# EasyEDA Pro project ProProject_audio_project_2024-04-19.epro

# Schematic Schematic1
Create Date: 2024-04-14; Page Name: P1; Project Name: audio_project; Schematic Name: Schematic1; Update Date: 2024-04-17; Company: 嘉立创EDA; Page Size: A4; Version: V1.0
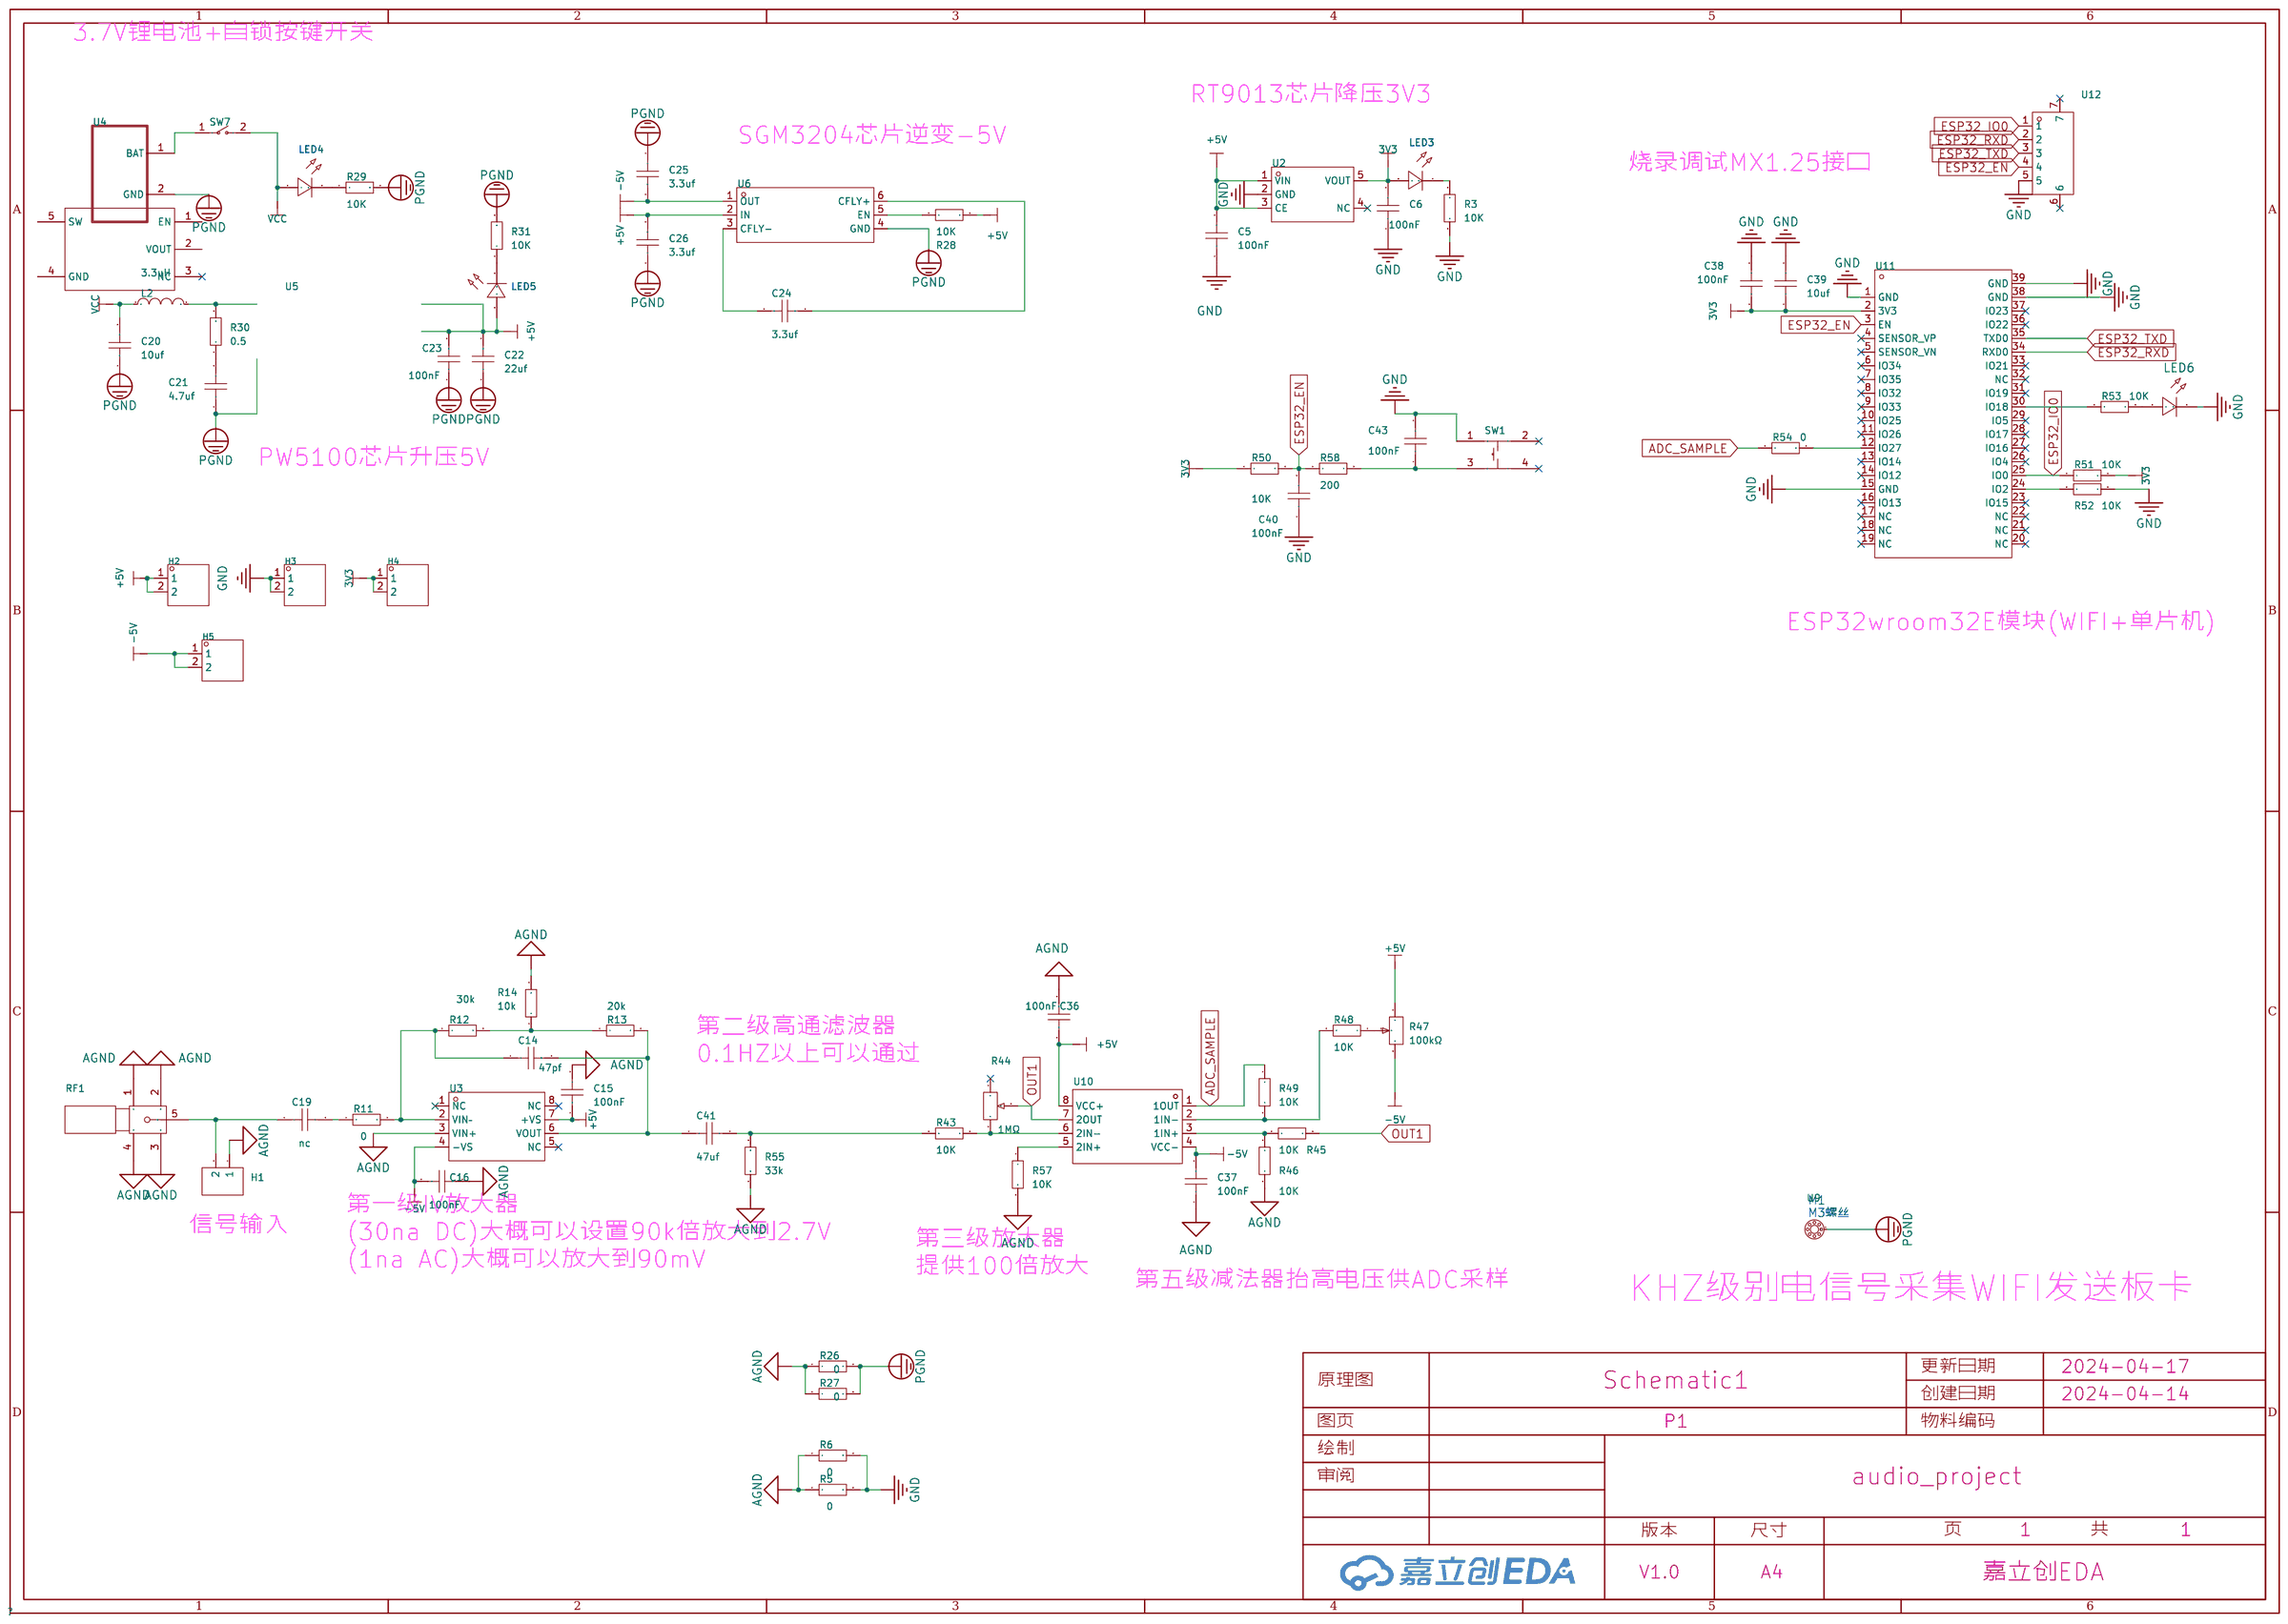
[diagram p0: schematic sheet]

## Parts
C5  100nF  [C0603]
C6  100nF  [C0603]
C14  47pf  [C0603]
C15  100nF  [C0603]
C16  100nF  [C0603]
C19  nc  [C0603]
C20  10uf  [C0805]
C21  4.7uf  [C0603]
C22  22uf  [C0805]
C23  100nF  [C0603]
C24  3.3uf  [C0603]
C25  3.3uf  [C0603]
C26  3.3uf  [C0603]
C36  100nF  [C0603]
C37  100nF  [C0603]
C38  100nF  [C0603]
C39  10uf  [C0805]
C40  100nF  [C0603]
C41  47uf  [C0805]
C43  100nF  [C0603]
H1  -  [HDR-TH_2P-P2.54-V-F]
H2  -  [HDR-TH_2P-P2.54-V-M-1]
H3  -  [HDR-TH_2P-P2.54-V-M-1]
H4  -  [HDR-TH_2P-P2.54-V-M-1]
H5  -  [HDR-TH_2P-P2.54-V-M-1]
L2  3.3uH  [IND-SMD_L4.0-W4.0_FNR40XXS]
LED3  -  [LED_0805]
LED4  -  [LED_0805]
LED5  -  [LED_0805]
LED6  -  [LED_0805]
R3  10K  [R0603]
R5  0  [R0603]
R6  0  [R0603]
R11  0  [R0603]
R12  30k  [R0603]
R13  20k  [R0603]
R14  10k  [R0603]
R26  0  [R0603]
R27  0  [R0603]
R28  10K  [R0603]
R29  10K  [R0603]
R30  0.5  [R0603]
R31  10K  [R0603]
R43  10K  [R0603]
R44  1MΩ  [RES-ADJ-TH_3P-L7.1-W6.9-P2.50-L_3362P]
R45  10K  [R0603]
R46  10K  [R0603]
R47  100kΩ  [RES-ADJ-TH_3296W]
R48  10K  [R0603]
R49  10K  [R0603]
R50  10K  [R0603]
R51  10K  [R0603]
R52  10K  [R0603]
R53  10K  [R0603]
R54  0  [R0603]
R55  33k  [R0603]
R57  10K  [R0603]
R58  200  [R0603]
RF1  BWSMA-KWE-Z001  [SMA-TH_BWSMA-KWE-Z001]
SW1  K2-1808SN-A3SW-01  [SW-SMD_4P-L4.2-W3.3-P2.15-LS5.1]
SW7  KCD11-2P-R  [SW-TH_2P-L15.0-W10.5-P5.00_KCD11-2P-R]
U2  RT9013-33GB-MS  [SOT-23-5_L2.9-W1.6-P0.95-LS2.8-BR]
U3  OPA657U  [SOIC-8_L4.9-W3.9-P1.27-LS6.0-TL]
U4  -  [两个焊盘]
U5  3c0bada92d29401ea73ee46ec49cffd6  [SOT-23-5_L2.9-W1.6-P0.95-LS2.8-TL]
U6  SGM3204YN6G/TR  [SOT-23-6_L2.9-W1.6-P0.95-LS2.8-BR]
U9  -  [m3]
U10  LF353DR  [SOIC-8_L5.0-W4.0-P1.27-LS6.0-BL]
U11  ESP32-WROOM-32E  [WIFI-SMD_ESP32-WROOM-32E-A]
U12  ZX-MX1.25-5PLT  [CONN-SMD_5P-P1.25_MEGASTAR_ZX-MX1.25-5PLT]

## Library data of the parts
C5 C6 C14-C16 C19 C21 C23-C26 C36-C38 C40 C43 = CAP_0603: Supplier Footprint: 0603
C20 C22 C39 C41 = CAP_0805: Supplier Footprint: 0805
H1 = HDR-F_2.54_1x2P: Supplier Part: C49661; Supplier Footprint: 插件
H2-H5 = HDR-M_2.54_1x2P: Supplier Part: C124375; Supplier Footprint: 插件
L2 = FNR4030S3R3MT: 电感值:3.3uH;精度:±20%;额定电流:2.6A;饱和电流(Isat):3.6A;; LCSC Part Name: 3.3uH ±20% 3.6A; Supplier Part: C167870; Manufacturer: cjiang(长江微电); Supplier Footprint: SMD,4x4mm; JLCPCB Part Class: 扩展库; Datasheet: https://atta.szlcsc.com/upload/public/pdf/source/20190327/C167925_9EFF0AABC4CA629C2CC95961DBF7D39D.pdf; Supplier: LCSC; Tolerance: ±20%; Rated Current: 2.6A; Saturation Current (Isat): 3.6A; DC Resistance (DCR): 52mΩ
LED3-LED5 = LED_0805-G: Supplier Footprint: 0805
LED6 = LED_0805-R: Supplier Footprint: 0805
R3 R5 R6 R11-R14 R26-R31 R43 R45 R46 R48-R55 R57 R58 = Res_0603: Supplier Footprint: 0603
R44 = 3362P-1-105: 阻值:1MΩ;精度:±10%;; LCSC Part Name: 1MΩ ±10%; Supplier Part: C118945; Manufacturer: BOCHEN(博晨); Supplier Footprint: 插件; JLCPCB Part Class: 扩展库; Datasheet: https://atta.szlcsc.com/upload/public/pdf/source/20171114/C118945_15106326627791117434.pdf; Supplier: LCSC; Tolerance: ±10%
R47 = 3296W-1-104LF: 阻值:100kΩ;精度:±10%;; LCSC Part Name: 100kΩ ±10%; Supplier Part: C48084; Manufacturer: BOURNS; Supplier Footprint: 插件; JLCPCB Part Class: 扩展库; Datasheet: https://atta.szlcsc.com/upload/public/pdf/source/20150811/1457707339453.pdf; Supplier: LCSC; Tolerance: ±10%
RF1 = BWSMA-KWE-Z001: 连接器类型:板端;接口类型:内孔;端口数量:1;接口直径:5.3mm;接口长度/高度:-;频率-最大值:-;射频系列:SMA;阻抗:50Ω;样式:弯头;触头材质:-;触头镀层:-;工作温度范围:-;焊接温度(最大值):-;; LCSC Part Name: 内孔 SMA 弯头; Supplier Part: C496551; Manufacturer: BAT WIRELESS(蝙蝠无线); Supplier Footprint: 插件; JLCPCB Part Class: 扩展库; Datasheet: https://atta.szlcsc.com/upload/public/pdf/source/20231017/997A8C2ADA7F8034A89BE1264F38CE52.pdf; Supplier: LCSC; Connector Type: 板端; Interface Type: 内孔; Number of Ports: 1; Interface Diameter: 5.3mm; RF Series: SMA; Impedance: 50Ω; Style: 弯头
SW1 = K2-1808SN-A3SW-01: 触点电流:50mA;额定电压(DC):12V;绝缘电阻:100MΩ;安装方式:立贴;作用力:180gf@±30gf;机械寿命:100000;工作温度:-25℃~+85℃;开关长度:4.2mm;开关宽度:3.25mm;开关高度:2.5mm;; LCSC Part Name: 3*4*2.5 贴片开关180G; Supplier Part: C2690012; Manufacturer: 韩国韩荣; Supplier Footprint: SMD; JLCPCB Part Class: 扩展库; Datasheet: https://atta.szlcsc.com/upload/public/pdf/source/20180927/C283535_7E7907F3E7B6C1691E1DC87E363D082A.pdf; Supplier: LCSC; Contact Current: 50mA; Voltage Rating (DC): 12V; Insulation Resistance: 100MΩ; Mounting Sytle: 立贴; Operating Force: 180gf@±30gf; Mechanical Life: 100000; Operating Temperature: -25℃~+85℃; Switch Length: 4.2mm; Switch Width: 3.25mm; Switch Height: 2.5mm
SW7 = KCD11-2P-R: 带灯:无;引脚样式:焊片;额定电流:3A;额定电压(AC):250V;额定电压(DC):-;电路结构:单刀单掷;机械寿命:1万次;; LCSC Part Name: 10.5*15mm 两脚两档跷板开关 红钮; Supplier Part: C5884414; Manufacturer: SHOU HAN(首韩); Supplier Footprint: 插件; JLCPCB Part Class: 扩展库; Datasheet: https://atta.szlcsc.com/upload/public/pdf/source/20230506/CD06DFDE35C8048D34175BFF4AF6A2C2.pdf; Supplier: LCSC; Switch Length: 15mm; Switch Width: 10.5mm; Switch Height: 17.2mm; Actuator Type: 凹面弯曲; With Lamp: 无; Pin Style: 焊片; Actuator Color: 红色; Contact Current: 3A; Voltage Rating (AC): 250V; Circuit: 单刀单掷; Mechanical Life: 1万次; Operating Temperature: 0℃~+125℃; Actuator Identifier: - O
U2 = RT9013-33GB-MS: 输出类型:固定;最大输入电压:5.5V;输出电压:3.3V;输出电流:500mA;电源纹波抑制比(PSRR):75dB@(1kHz);输出极性:正极;; Supplier Part: C7434207; Manufacturer: MSKSEMI(美森科); Supplier Footprint: SOT-23-5; JLCPCB Part Class: 扩展库; Datasheet: https://atta.szlcsc.com/upload/public/pdf/source/20230705/1D6536D82D93AC1E044F3DAE104751D9.pdf; Supplier: LCSC; Output Type: 固定; Maximum Input Voltage: 5.5V; Output Voltage: 3.3V; Output Current: 500mA; Power Supply Rejection Ratio (PSRR): 75dB@(1kHz); Output Polarity: 正极
U3 = OPA657U: 1.6GHz、低噪声、FET 输入运算放大器 8-SOIC -40 to 85; Supplier Part: C2878144; Manufacturer: TI(德州仪器); Supplier Footprint: SOIC-8; JLCPCB Part Class: 扩展库; Supplier: LCSC
U4 = 两个焊盘
U5 = PW5100: 锂电池DC-DC高效同步升压变换器
U6 = SGM3204YN6G/TR: 功能类型:电荷泵;输入电压:1.4V~5.5V;输出电压:-5.5V~-1.4V;输出电流(最大值):200mA;; Supplier Part: C194031; Manufacturer: SGMICRO(圣邦微); Supplier Footprint: SOT-23-6; JLCPCB Part Class: 扩展库; Datasheet: https://atta.szlcsc.com/upload/public/pdf/source/20180627/C194031_755051E53122D645C36CF727711B963E.pdf; Supplier: LCSC; Function: 电荷泵; Input Voltage: 1.4V~5.5V; Output Voltage: -5.5V~-1.4V; Output Current (Max): 200mA; Switching Frequency: 950kHz; Number of Outputs: 1
U9 = M3焊盘
U10 = LF353DR: 运放类型:J-FET;放大器组数:2;增益带宽积（GBP）:3MHz;压摆率（SR）:13 V/us;电源电压:±3.5V ~ 18V;各通道供电电流:3.6mA;; Supplier Part: C7918; Manufacturer: TI(德州仪器); Supplier Footprint: SOIC-8-150mil; JLCPCB Part Class: 扩展库; Datasheet: https://atta.szlcsc.com/upload/public/pdf/source/20180308/C7918_15204885487891413793.pdf; Supplier: LCSC; Amplifier Type: J-FET; Number of Circuits: 2; Gain Bandwidth Product（GBP）: 3MHz; Slew Rate（SR）: 13 V/us; Supply Voltage（Single）: ±3.5V ~ 18V; Iq per channel (Typ): 3.6mA; Operating Temperature: 0°C ~ 70°C
U11 = ESP32-WROOM-32E: Supplier Part: C2973652; Manufacturer: ESPRESSIF(乐鑫); Supplier Footprint: SMD,18x25.5mm; JLCPCB Part Class: Extended Part; Datasheet: https://atta.szlcsc.com/upload/public/pdf/source/20220506/2B7DF1E5B41DABC7447F735C715CAF22.pdf; Supplier: LCSC
U12 = ZX-MX1.25-5PLT: 插针结构:1x5P;间距:1.25mm;安装方式:立贴;参考系列:-;总PIN数:5P;排数:1;每排PIN数:5;行距:-;额定电流:1A;触头材质:黄铜;触头镀层:锡;工作温度范围:-25℃~+85℃;; LCSC Part Name: 1x5P 间距:1.25mm 立贴; Supplier Part: C7430476; Manufacturer: Megastar(兆星); Supplier Footprint: SMD,P=1.25mm; JLCPCB Part Class: 扩展库; Datasheet: https://atta.szlcsc.com/upload/public/pdf/source/20230619/51DE3896F53EA722A95969B8F38DD13F.pdf; Supplier: LCSC; Pins Structure: 1x5P; Pitch: 1.25mm; Mounting Style: 立贴; Number of Pins: 5P; Number of Rows: 1; Number of PINs Per Row: 5; Current Rating (Max): 1A; Contact Material: 黄铜; Contact Plating: 锡; Operating Temperature Range: -25℃~+85℃

## Nets
3V3: C6.2 C38.2 C39.1 H4.1 H4.2 LED3.2(A) R50.1 R51.2 U2.5(VOUT) U11.2(3V3)
+5V: C5.2 C15.1 C22.2 C23.2 C26.2 C36.1 H2.1 H2.2 LED5.2(A) R28.2 R47.1 U2.1(VIN) U2.3(CE) U3.7(+VS) U6.2(IN) U10.8(VCC+)
-5V: C16.2 C25.2 C37.2 H5.1 H5.2 R47.3 U3.4(-VS) U6.1(OUT) U10.4(VCC-)
AGND: C15.2 C16.1 C36.2 C37.1 H1.1 R5.1 R6.1 R14.2 R26.1 R27.1 R46.1 R55.1 R57.2 RF1.1 RF1.2 RF1.3 RF1.4 U3.3(VIN+)
GND: C5.1 C6.1 C38.1 C39.2 C40.1 C43.2 H3.1 H3.2 LED6.1(C) R3.2 R5.2 R6.2 R52.2 SW1.1 U2.2(GND) U11.1(GND) U11.15(GND) U11.38(GND) U11.39(GND) U12.5
PGND: C20.1 C21.1 C22.1 C23.1 C25.1 C26.1 R26.2 R27.2 R29.2 R31.2 U4.2(GND) U6.4(GND) U9.1
VCC: C20.2 L2.1 LED4.2(A) SW7.2
ADC_SAMPLE: R49.1 R54.1 U10.1(1OUT)
ESP32_EN: C40.2 R50.2 R58.1 U11.3(EN) U12.4
ESP32_IO0: R51.1 U11.25(IO0) U12.1
ESP32_RXD: U11.34(RXD0) U12.2
ESP32_TXD: U11.35(TXD0) U12.3
OUT1: R44.2 R45.2 U10.7(2OUT)
$1N488: R12.2 R13.1 R14.1
$1N489: C14.1 R11.2 R12.1 U3.2(VIN–)
$1N495: C19.2 R11.1
$1N540: C19.1 H1.2 RF1.5
$1N708: LED4.1(C) R29.1
$1N711: SW7.1 U4.1(BAT)
$1N1130: C21.2 R30.1
$1N1484: C24.2 U6.3(CFLY-)
$1N1485: C24.1 U6.6(CFLY+)
$1N1490: R28.1 U6.5(EN)
$1N1557: LED5.1(C) R31.1
$1N1776: LED3.1(C) R3.1
$1N5623: R43.1 R44.3 U10.6(2IN-)
$1N5830: R45.1 R46.2 U10.3(1IN+)
$1N5955: R47.2 R48.1
$1N5959: R48.2 R49.2 U10.2(1IN-)
$1N8059: R52.1 U11.24(IO2)
$1N8471: R53.1 U11.30(IO18)
$1N8523: LED6.2(A) R53.2
$1N8889: R54.2 U11.12(IO27)
$1N15972: C14.2 C41.1 R13.2 U3.6(VOUT)
$1N16222: R57.1 U10.5(2IN+)
$1N16765: C43.1 R58.2 SW1.3
Net-(C41-2): C41.2 R43.2 R55.2
Net-(L2-2): L2.2 R30.2

Not connected (* = marked no-connect by the designer): R44 1*; SW1 2* 4*; U2 4(NC)*; U3 1(NC)* 5(NC)* 8(NC)*; U5 1(EN) 2(VOUT) 3(NC)* 4(GND) 5(SW); U11 4(SENSOR_VP)* 5(SENSOR_VN)* 6(IO34)* 7(IO35)* 8(IO32)* 9(IO33)* 10(IO25)* 11(IO26)* 13(IO14)* 14(IO12)* 16(IO13)* 17(NC)* 18(NC)* 19(NC)* 20(NC)* 21(NC)* 22(NC)* 23(IO15)* 26(IO4)* 27(IO16)* 28(IO17)* 29(IO5)* 31(IO19)* 32(NC)* 33(IO21)* 36(IO22)* 37(IO23)*; U12 6* 7*

## Notes on the sheet
- 3.7V锂电池+自锁按键开关
- RT9013芯片降压3V3
- SGM3204芯片逆变-5V
- 烧录调试MX1.25接口
- PW5100芯片升压5V
- ESP32wroom32E模块(WIFI+单片机)
- 第二级高通滤波器
  0.1HZ以上可以通过
- 信号输入
- 第一级IV放大器
  (30na DC)大概可以设置90k倍放大到2.7V
  (1na AC)大概可以放大到90mV
- 第三级放大器
  提供100倍放大
- 第五级减法器抬高电压供ADC采样
- KHZ级别电信号采集WIFI发送板卡

# Board PCB1
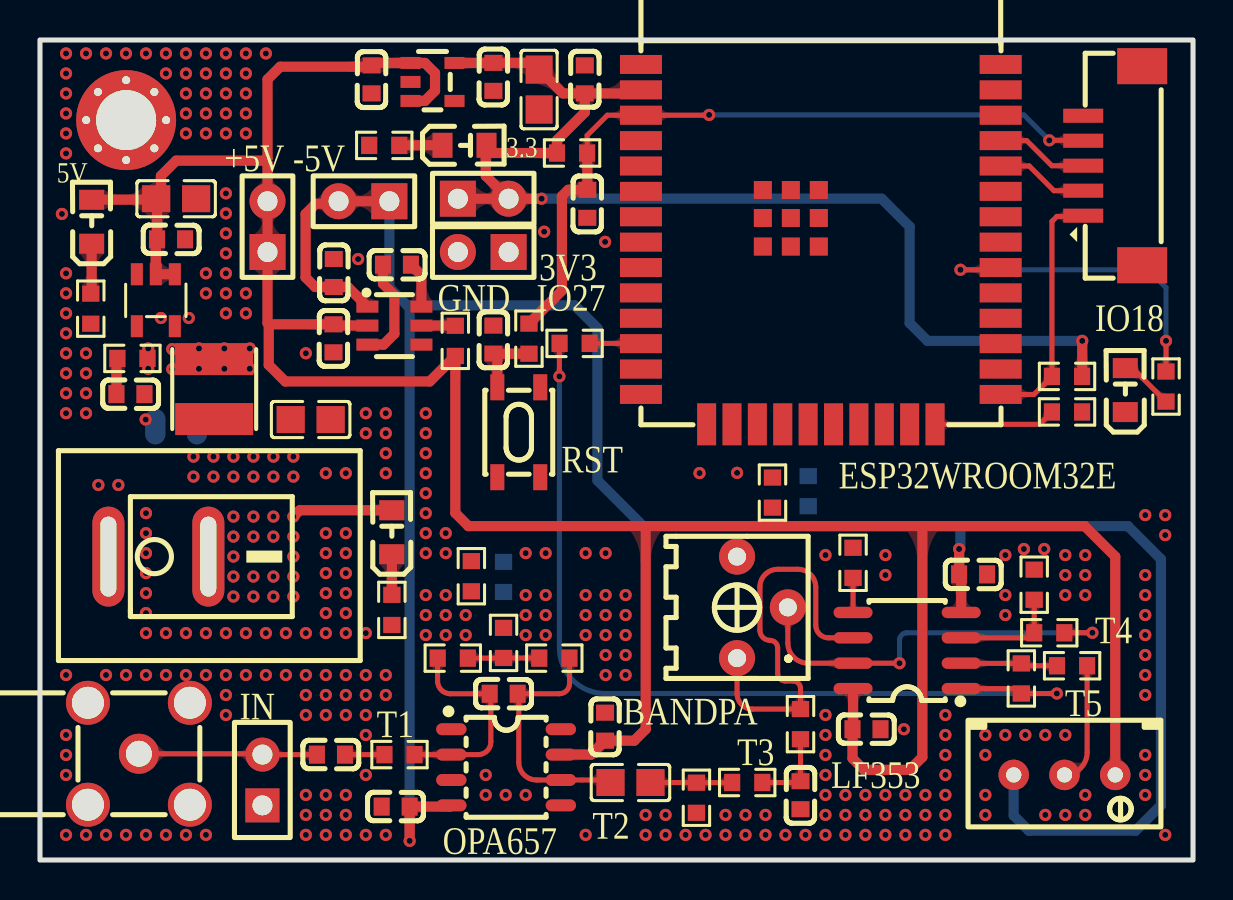
[diagram p1: board, top side]
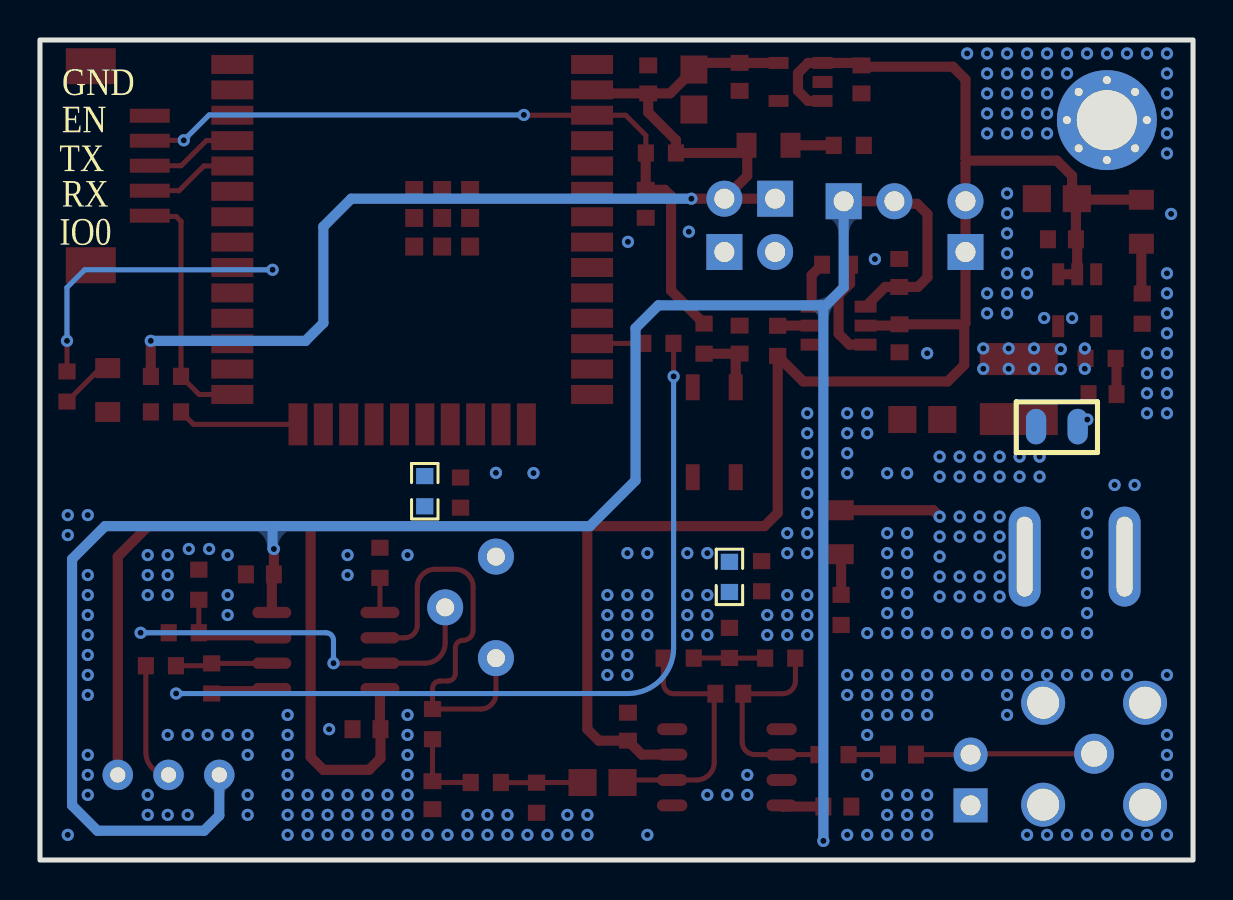
[diagram p2: board, bottom side, seen from below]

Outline 57.7 x 41.03 mm; copper layers: Top Layer, Bottom Layer. Coordinates in mm from the lower left corner of the outline.
Outline path: rectangle 0,0 57.7,41.03
Stack: Top Layer 0.035mm / Dielectric1 1.51mm FR4 er 4.5 / Bottom Layer 0.035mm

## Design rules (mm)
template: 自定义配置
spacing copperThickness1oz (default): track to track 0.102, other pairs 0.152 to 0.3
spacing copperThickness2oz: track to track 0.203, other pairs 0.152 to 0.3
track width copperThickness1oz (default): min 0.127, default 0.254, max 2.54
track width copperThickness2oz: min 0.203, default 0.254, max 2.54
differential pair differentialPair (default): width min 0.127, default 0.254, max 2.54; gap min 0.152, default 0.152
via viaSize (default): diameter min 0.5, default 0.61, max 10; hole min 0.3, default 0.305, max 6.3

## Placement (name value [footprint] x y rotation side)
C5  100nF  [C0603]  16.59 39.06 90 top
C6  100nF  [C0603]  22.69 39.18 90 top
C14  47pf  [C0603]  23.2 8.32 0 top
C15  100nF  [C0603]  28.28 6.67 90 top
C16  100nF  [C0603]  17.8 2.67 0 top
C19  nc  [C0603]  14.56 5.27 0 top
C20  10uf  [C0805]  13.54 22.04 180 top
C21  4.7uf  [C0603]  4.53 23.31 180 top
C22  22uf  [C0805]  6.81 33.09 180 top
C23  100nF  [C0603]  6.56 31.06 180 top
C24  3.3uf  [C0603]  17.86 29.79 180 top
C25  3.3uf  [C0603]  14.7 29.37 270 top
C26  3.3uf  [C0603]  14.69 26.1 90 top
C36  100nF  [C0603]  41.36 6.54 0 top
C37  100nF  [C0603]  46.69 14.29 180 top
C38  100nF  [C0603]  27.26 39.06 270 top
C39  10uf  [C0805]  24.97 38.55 270 top
C40  100nF  [C0603]  27.39 32.83 90 top
C41  47uf  [C0805]  29.55 3.88 0 top
C42  470nF  [C0603]  38.05 3.24 90 top
C43  100nF  [C0603]  22.69 26.04 90 top
H1  -  [HDR-TH_2P-P2.54-V-F]  11.13 4 90 top
H2  -  [HDR-TH_2P-P2.54-V-M-1]  11.39 31.69 90 top
H3  -  [HDR-TH_2P-P2.54-V-M-1]  22.18 30.42 180 top
H4  -  [HDR-TH_2P-P2.54-V-M-1]  22.18 33.09 0 top
H5  -  [HDR-TH_2P-P2.54-V-M-1]  16.21 32.96 180 top
L2  3.3uH  [IND-SMD_L4.0-W4.0_FNR40XXS]  8.72 23.56 90 top
LED3  -  [LED_0805]  21.29 35.75 0 top
LED4  -  [LED_0805]  17.61 16.45 90 top
LED5  -  [LED_0805]  2.59 31.98 90 top
LED6  -  [LED_0805]  54.31 23.56 90 top
R3  10K  [R0603]  17.23 35.75 180 top
R5  0  [R0603]  38.44 18.45 90 bottom
R6  0  [R0603]  36.65 18.38 90 top
R11  0  [R0603]  17.99 5.27 0 top
R12  30k  [R0603]  20.66 10.1 0 top
R13  20k  [R0603]  25.74 10.1 0 top
R14  10k  [R0603]  23.2 10.86 90 top
R26  0  [R0603]  21.58 14.2 90 top
R27  0  [R0603]  23.2 14.16 90 bottom
R28  10K  [R0603]  20.78 25.98 270 top
R29  10K  [R0603]  17.61 12.51 270 top
R30  0.5  [R0603]  4.63 25.1 0 top
R31  10K  [R0603]  2.54 27.59 270 top
R43  10K  [R0603]  38.05 6.8 270 top
R44  1MΩ  [RES-ADJ-TH_3P-L7.1-W6.9-P2.50-L_3362P]  36.15 12.64 270 top
R45  10K  [R0603]  50.5 11.37 0 top
R46  10K  [R0603]  49.75 13.78 270 top
R47  100kΩ  [RES-ADJ-TH_3296W]  51.26 4.26 270 top
R48  10K  [R0603]  51.64 9.72 180 top
R49  10K  [R0603]  49.1 9.08 90 top
R50  10K  [R0603]  26.62 35.37 0 top
R51  10K  [R0603]  51.39 24.2 0 top
R52  10K  [R0603]  51.39 22.42 0 top
R53  10K  [R0603]  56.34 23.69 270 top
R54  0  [R0603]  26.75 25.85 0 top
R55  33k  [R0603]  32.85 3.12 90 top
R56  33k  [R0603]  35.39 3.88 0 top
R57  10K  [R0603]  40.68 14.87 90 top
R58  200  [R0603]  24.47 26.09 270 top
RF1  BWSMA-KWE-Z001  [SMA-TH_BWSMA-KWE-Z001]  4.95 5.32 180 top
SW1  K2-1808SN-A3SW-01  [SW-SMD_4P-L4.2-W3.3-P2.15-LS5.1]  23.96 21.4 270 top
SW7  KCD11-2P-R  [SW-TH_2P-L15.0-W10.5-P5.00_KCD11-2P-R]  5.92 15.18 0 top
U2  RT9013-33GB-MS  [SOT-23-5_L2.9-W1.6-P0.95-LS2.8-BR]  19.64 38.93 180 top
U3  OPA657U  [SOIC-8_L4.9-W3.9-P1.27-LS6.0-TL]  23.32 4.64 0 top
U4  -  [两个焊盘]  4.53 20.01 90 bottom
U5  3c0bada92d29401ea73ee46ec49cffd6  [SOT-23-5_L2.9-W1.6-P0.95-LS2.8-TL]  5.8 28.01 270 top
U6  SGM3204YN6G/TR  [SOT-23-6_L2.9-W1.6-P0.95-LS2.8-BR]  17.73 26.74 180 top
U9  -  [m3]  4.31 37.02 0 top
U10  LF353DR  [SOIC-8_L5.0-W4.0-P1.27-LS6.0-BL]  43.39 10.48 90 top
U11  ESP32-WROOM-32E  [WIFI-SMD_ESP32-WROOM-32E-A]  39.07 30.8 0 top
U12  ZX-MX1.25-5PLT  [CONN-SMD_5P-P1.25_MEGASTAR_ZX-MX1.25-5PLT]  53.68 34.74 90 top

## Footprints (pads in the part's own frame, mm; a bottom-side part is the same pattern mirrored in y, then rotated)
C0603
  rect 0.8x0.9 smd: 1(-0.7,0) 2(0.7,0)
C0805
  rect 1.41x1.35 smd: 1(-1,0) 2(1,0)
CONN-SMD_5P-P1.25_MEGASTAR_ZX-MX1.25-5PLT
  rect 0.7x2 smd: 1(-2.5,1.475) 2(-1.25,1.475) 3(0,1.475) 4(1.25,1.475) 5(2.5,1.475)
  rect 1.8x2.5 smd: 6(4.98,-1.475) 7(-4.98,-1.475)
HDR-TH_2P-P2.54-V-F
  rect 1.7x1.7 hole 1: 1(-1.27,0)
  round 1.7 hole 1: 2(1.27,0)
HDR-TH_2P-P2.54-V-M-1
  rect 1.8x1.8 hole 1: 1(-1.27,0)
  round 1.8 hole 1: 2(1.27,0)
IND-SMD_L4.0-W4.0_FNR40XXS
  rect 1.6x3.9 smd: 1(-1.5,0) 2(1.5,0)
LED_0805
  rect 1x1.25 smd: 1(-1.15,0.005) 2(1.05,0.005)
m3
  round 0.6 hole 0.405x0.4: 1(-2,0) 1(-1.41,1.41) 1(-1.41,-1.41) 1(0,2) 1(0,-2) 1(1.41,1.41) 1(1.41,-1.41) 1(2,0)
  round 5 hole 3.005x3: 1(0,0)
R0603
  rect 0.806x0.864 smd: 1(-0.753,0) 2(0.753,0)
RES-ADJ-TH_3P-L7.1-W6.9-P2.50-L_3362P
  round 1.8 hole 0.9: 1(-2.54,-1.27) 2(0,1.27) 3(2.54,-1.27)
RES-ADJ-TH_3296W
  round 1.524 hole 0.762: 1(0,2.54) 2(0,0) 3(0,-2.54)
SMA-TH_BWSMA-KWE-Z001
  round 2.2 hole 1.6: 1(-2.55,-2.55) 2(-2.55,2.55) 3(2.55,2.55) 4(2.55,-2.55)
  round 2 hole 1.3: 5(0,0)
SOIC-8_L4.9-W3.9-P1.27-LS6.0-TL
  oval 1.52x0.6 smd: 1(-2.74,1.905) 2(-2.74,0.635) 3(-2.74,-0.635) 4(-2.74,-1.905) 5(2.74,-1.905) 6(2.74,-0.635) 7(2.74,0.635) 8(2.74,1.905)
SOIC-8_L5.0-W4.0-P1.27-LS6.0-BL
  oval 0.569x1.95 smd: 1(-1.905,-2.705) 2(-0.635,-2.705) 3(0.635,-2.705) 4(1.905,-2.705) 5(1.905,2.705) 6(0.635,2.705) 7(-0.635,2.705) 8(-1.905,2.705)
SOT-23-5_L2.9-W1.6-P0.95-LS2.8-BR
  rect 1x0.6 smd: 1(1.1,-0.95) 2(1.1,0) 3(1.1,0.95) 4(-1.1,0.95) 5(-1.1,-0.95)
SOT-23-5_L2.9-W1.6-P0.95-LS2.8-TL
  rect 1.1x0.6 smd: 1(-1.3,0.95) 2(-1.3,0) 3(-1.3,-0.95) 4(1.3,-0.95) 5(1.3,0.95)
SOT-23-6_L2.9-W1.6-P0.95-LS2.8-BR
  rect 1.1x0.6 smd: 1(1.35,-0.95) 2(1.35,0) 3(1.35,0.95) 4(-1.35,0.95) 5(-1.35,0) 6(-1.35,-0.95)
SW-SMD_4P-L4.2-W3.3-P2.15-LS5.1
  rect 1.3x0.7 smd: 1(-2.25,1.075) 2(2.25,1.075) 3(-2.25,-1.075) 4(2.25,-1.075)
SW-TH_2P-L15.0-W10.5-P5.00_KCD11-2P-R
  oval 1.6x5 hole 0.8x4: 1(-2.5,0) 2(2.5,0)
WIFI-SMD_ESP32-WROOM-32E-A
  rect 2.1x0.95 smd: 1(-9,9.002) 2(-9,7.732) 3(-9,6.463) 4(-9,5.192) 5(-9,3.922) 6(-9,2.652) 7(-9,1.383) 8(-9,0.113) 9(-9,-1.157) 10(-9,-2.428) 11(-9,-3.697) 12(-9,-4.968) 13(-9,-6.237) 14(-9,-7.508) 25(9,-7.508) 26(9,-6.237) 27(9,-4.968) 28(9,-3.697) 29(9,-2.428) 30(9,-1.157) 31(9,0.113) 32(9,1.383) 33(9,2.652) 34(9,3.922) 35(9,5.192) 36(9,6.463) 37(9,7.732) 38(9,9.002)
  rect 0.95x2.1 smd: 15(-5.715,-9.002) 16(-4.444,-9.002) 17(-3.175,-9.002) 18(-1.905,-9.002) 19(-0.634,-9.002) 20(0.635,-9.002) 21(1.905,-9.002) 22(3.175,-9.002) 23(4.446,-9.002) 24(5.715,-9.002)
  rect 0.9x0.9 smd: 39(-2.9,2.721) 39(-2.9,1.321) 39(-2.9,-0.108) 39(-1.5,2.721) 39(-1.5,1.321) 39(-1.5,-0.108) 39(-0.1,2.721) 39(-0.1,1.321) 39(-0.1,-0.108)
两个焊盘
  oval 1.778x1.016 smd: 1(1.677,1.244) 2(1.677,3.328)

## Nets
As in the schematic, except:
+5V: C5.2 C15.1 C22.2 C23.2 C26.2 C36.1 H2.1 H2.2 LED5.2 R28.2 R47.1 U2.1 U2.3 U3.7 U5.1 U5.2 U6.2 U10.8
AGND: C15.2 C16.1 C36.2 C37.1 C42.1 H1.1 R5.1 R6.1 R14.2 R26.1 R27.1 R46.1 R55.1 R57.2 RF1.1 RF1.2 RF1.3 RF1.4 U3.3
PGND: C20.1 C21.1 C22.1 C23.1 C25.1 C26.1 R26.2 R27.2 R29.2 R31.2 U4.2 U5.4 U6.4 U9.1
$1N1033: L2.2 R30.2 U5.5
$1N16056: C41.2 R55.2 R56.1
$1N16195: C42.2 R43.2 R56.2

Pads without a net: R44 1; SW1 2 4; U2 4; U3 1 5 8; U5 3; U11 4 5 6 7 8 9 10 11 13 14 16 17 18 19 20 21 22 23 26 27 28 29 31 32 33 36 37; U12 6 7

## Via types
v1: diameter 0.61, hole 0.305, Top Layer to Bottom Layer, 28 vias
v2: diameter 0.61, hole 0.304, Top Layer to Bottom Layer, 309 vias

## Routing (per net, layer and track width the routed paths; a pad name or vN(x,y) marks a point on that pad's centre or on a via; arc(x,y) is an arc through that point)
3V3: length 59
  Top Layer w0.508: H4.2 H4.1 ; H4.2 v1(25.1,33.09) ; H4.2 22.31,34.23 22.31,35.5 ; R51.2 52.15,24.21 v1(52.15,25.98) ; 27.26,38.36 27.26,37.41 25.87,36.02 R50.1 22.73,35.37 22.34,35.76 ; 27.26,38.36 26.17,38.36 C39.1 24.64,39.88 C6.2 22.68,39.88 U2.5 ; 27.26,38.36 29.89,38.36 U11.2
  Bottom Layer w0.508: v1(52.15,25.98) 44.4,25.98 43.52,26.86 43.52,31.69 42.12,33.09 v1(25.1,33.09)
+5V: length 142.4
  Top Layer w0.508: 11.26,34.99 6.81,34.99 6.05,34.23 6.05,33.33 C22.2 5.86,33.04 ; 11.26,34.99 11.39,34.87 H2.1 11.39,26.86 11.45,26.8 ; 11.26,34.99 11.39,35.12 11.39,39.06 12.02,39.69 16.53,39.69 C5.2 16.71,39.88 U2.1 19.26,39.88 19.77,39.37 19.77,38.49 19.26,37.98 U2.3 ; U5.1 U5.2 5.8,30.99 C23.2 5.86,33.04 ; 11.45,26.8 11.45,24.77 12.27,23.94 19.5,23.94 R28.2 20.78,17.36 21.44,16.7 30.35,16.7 ; 11.45,26.8 C26.2 14.75,26.74 U6.2 ; 30.35,16.7 44.26,16.7 ; 30.35,16.7 30.31,16.66 30.31,6.54 29.73,5.97 C15.1 27.58,5.27 U3.7 ; LED5.2 2.59,33.04 5.86,33.04 ; 53.8,4.26 53.8,15.18 52.28,16.7 44.26,16.7 ; 44.26,16.7 44.15,16.6 44.15,5.15 43.52,4.51 41.23,4.51 40.66,5.09 C36.1 40.68,6.57 U10.8
-5V: length 122
  Top Layer w0.508: U10.4 46.09,14.19 C37.2 v1(45.99,15.56) ; H5.1 H5.2 14.81,32.83 13.8,32.83 13.29,32.33 13.29,29.15 13.77,28.67 C25.2 15.4,28.67 U6.1 ; v1(18.5,0.96) C16.2 20.52,2.67 20.58,2.73
  Bottom Layer w0.508: 46.01,16.7 30.18,16.7 27.89,18.99 27.89,26.61 26.75,27.75 18.62,27.75 ; 46.01,16.7 46.06,16.66 46.06,15.56 v1(45.99,15.56) ; 46.01,16.7 54.44,16.7 56.09,15.05 56.09,2.73 54.82,1.46 49.48,1.46 48.72,2.23 R47.3 ; H5.1 17.48,28.64 18.37,27.75 18.62,27.75 ; 18.62,27.75 18.5,27.63 v1(18.5,0.96)
AGND:
  vias: v2(1.3,9.26) v2(1.3,6.26) v2(1.3,5.26) v2(1.3,4.26) v2(1.3,1.26) v2(2.3,1.26) v2(3.3,9.26) v2(3.3,1.26) v2(4.3,9.26) v2(4.3,1.26) v2(5.3,9.26) v2(5.3,1.26) v2(6.3,9.26) v2(6.3,1.26) v2(7.3,9.26) v2(7.3,1.26) v2(8.3,9.26) v2(8.3,1.26) v2(9.3,9.26) v2(9.3,8.26) v2(9.3,7.26) v2(10.3,9.26) v2(11.3,9.26) v2(12.3,9.26) v2(13.3,9.26) v2(13.3,8.26) v2(13.3,7.26) v2(13.3,3.26) v2(13.3,2.26) v2(13.3,1.26) v2(14.3,9.26) v2(14.3,8.26) v2(14.3,7.26) v2(14.3,3.26) v2(14.3,2.26) v2(14.3,1.26) v2(15.3,9.26) v2(15.3,8.26) v2(15.3,7.26) v2(15.3,3.26) v2(15.3,2.26) v2(15.3,1.26) v2(16.3,9.26) v2(16.3,8.26) v2(16.3,7.26) v2(16.3,6.26) v2(16.3,4.26) v2(16.3,1.26) v2(17.3,9.26) v2(17.3,8.26) v2(17.3,1.26) v2(19.3,13.26) v2(19.3,12.26) v2(19.3,11.26) v2(20.3,13.26) v2(20.3,12.26) v2(20.3,11.26) v2(21.3,12.26) v2(21.3,11.26) v2(22.3,4.26) v2(22.3,3.26) v2(23.3,3.26) v2(24.3,13.26) v2(24.3,12.26) v2(24.3,11.26) v2(24.3,3.26) v2(25.3,13.26) v2(25.3,12.26) v2(25.3,11.26) v2(27.3,13.26) v2(27.3,12.26) v2(27.3,11.26) v2(27.3,1.26) v2(28.3,13.26) v2(28.3,12.26) v2(28.3,11.26) v2(28.3,10.26) v2(28.3,9.26) v2(29.3,13.26) v2(29.3,12.26) v2(29.3,11.26) v2(29.3,10.26) v2(29.3,9.26) v2(30.3,2.26) v2(30.3,1.26) v2(31.3,2.26) v2(31.3,1.26) v2(32.3,1.26) v2(33.3,1.26) v2(34.3,2.26) v2(34.3,1.26) v2(35.3,2.26) v2(35.3,1.26) v2(36.3,2.26) v2(36.3,1.26) v2(37.3,1.26) v2(38.3,1.26) v2(39.3,15.26) v2(39.3,7.26) v2(39.3,6.26) v2(39.3,5.26) v2(39.3,4.26) v2(39.3,3.26) v2(39.3,2.26) v2(39.3,1.26) v2(40.3,3.26) v2(40.3,2.26) v2(40.3,1.26) v2(41.3,3.26) v2(41.3,2.26) v2(41.3,1.26) v2(42.3,15.26) v2(42.3,14.26) v2(42.3,3.26) v2(42.3,2.26) v2(42.3,1.26) v2(43.23,6.54) v2(43.3,3.26) v2(43.3,2.26) v2(43.3,1.26) v2(44.3,3.26) v2(44.3,2.26) v2(44.3,1.26) v2(45.3,7.26) v2(45.3,6.26) v2(45.3,5.26) v2(45.3,4.26) v2(45.3,3.26) v2(45.3,2.26) v2(45.3,1.26) v2(47.3,6.26) v2(47.3,5.26) v2(47.3,3.26) v2(47.3,2.26) v2(48.3,15.26) v2(48.3,13.26) v2(48.3,12.26) v2(48.3,6.26) v2(49.23,15.56) v2(49.3,6.26) v2(50.25,15.56) v2(50.3,6.26) v2(50.3,2.26) v2(51.3,15.26) v2(51.3,14.26) v2(51.3,13.26) v2(51.3,6.26) v2(51.3,2.26) v2(52.3,15.26) v2(52.3,14.26) v2(52.3,13.26) v2(52.3,3.26) v2(52.3,2.26) v2(55.3,17.26) v2(55.3,14.26) v2(55.3,13.26) v2(55.3,12.26) v2(55.3,11.26) v2(55.3,10.26) v2(55.3,9.26) v2(55.3,8.26) v2(55.3,5.26) v2(55.3,4.26) v2(55.3,3.26) v2(56.3,17.26) v2(56.3,16.26) v2(56.3,1.26)
GND:
  vias: v1(25.23,31.44) v1(28.28,30.93) v1(33,19.36) v1(34.88,19.37)
PGND:
  vias: v2(1.1,32.33) v2(1.3,40.35) v2(1.3,39.35) v2(1.3,38.35) v2(1.3,37.35) v2(1.3,36.35) v2(1.3,35.35) v2(1.3,29.35) v2(1.3,28.35) v2(1.3,27.35) v2(1.3,26.35) v2(1.3,25.35) v2(1.3,24.35) v2(1.3,23.35) v2(1.3,22.35) v2(2.3,40.35) v2(2.3,25.35) v2(2.3,24.35) v2(2.3,23.35) v2(2.3,22.35) v2(3.3,40.35) v2(4.3,40.35) v2(5.3,40.35) v2(5.29,22.04) v2(5.3,17.35) v2(5.3,16.35) v2(5.3,15.35) v2(5.3,14.35) v2(5.3,13.35) v2(5.3,12.35) v2(5.3,11.35) v2(6.3,40.35) v2(6.3,39.35) v2(6.3,11.35) v2(7.3,40.35) v2(7.3,39.35) v2(7.3,38.35) v2(7.3,37.35) v2(7.3,36.35) v2(7.3,11.35) v2(8.3,40.35) v2(8.3,39.35) v2(8.3,38.35) v2(8.3,37.35) v2(8.3,36.35) v2(8.3,29.35) v2(8.3,28.35) v2(8.3,11.35) v2(9.3,40.35) v2(9.3,39.35) v2(9.3,38.35) v2(9.3,37.35) v2(9.3,36.35) v2(9.3,33.35) v2(9.3,32.35) v2(9.3,31.35) v2(9.3,30.35) v2(9.3,29.35) v2(9.3,28.35) v2(9.3,27.35) v2(9.3,11.35) v2(10.3,40.35) v2(10.3,39.35) v2(10.3,38.35) v2(10.3,37.35) v2(10.3,36.35) v2(10.3,28.35) v2(10.3,27.35) v2(10.3,11.35) v2(11.3,40.35) v2(11.3,11.35) v2(12.3,11.35) v2(13.3,25.35) v2(13.3,11.35) v2(14.3,19.35) v2(14.3,16.35) v2(14.3,15.35) v2(14.3,14.35) v2(14.3,13.35) v2(14.3,12.35) v2(14.3,11.35) v2(15.3,19.35) v2(15.3,16.35) v2(15.3,15.35) v2(15.3,14.35) v2(15.3,13.35) v2(15.3,12.35) v2(15.3,11.35) v2(15.92,30.07) v2(16.3,22.35) v2(16.3,21.35) v2(16.3,11.35) v2(17.3,22.35) v2(17.3,21.35) v2(17.3,20.35) v2(17.3,19.35) v2(19.3,22.35) v2(19.3,21.35) v2(19.3,20.35) v2(19.3,19.35) v2(19.3,18.35) v2(19.3,17.35) v2(19.3,16.35) v2(19.3,15.35) v2(20.3,16.35) v2(20.3,15.35) v2(24.3,15.35) v2(25.3,15.35) v2(27.3,15.35) v2(28.3,15.35)
VCC: length 5.1
  Top Layer w0.508: LED4.2 13,17.5 v2(12.68,17.18)
  vias: v2(7.68,20.18) v2(7.68,19.18) v2(8.68,20.18) v2(8.68,19.18) v2(9.68,20.18) v2(9.68,19.18) v2(9.68,17.18) v2(9.68,16.18) v2(9.68,15.18) v2(9.68,14.18) v2(9.68,13.18) v2(10.68,20.18) v2(10.68,19.18) v2(10.68,17.18) v2(10.68,16.18) v2(10.68,14.18) v2(10.68,13.18) v2(11.68,20.18) v2(11.68,19.18) v2(11.68,17.18) v2(11.68,16.18) v2(11.68,14.18) v2(11.68,13.18) v2(12.68,20.18) v2(12.68,19.18) v2(12.68,16.18) v2(12.68,15.18) v2(12.68,14.18) v2(12.68,13.18)
ADC_SAMPLE: length 46.4
  Top Layer w0.254: U10.1 48.86,8.58 arc(49.03,8.51) R49.1 v1(50.88,8.33) ; v1(25.99,24.2) 25.99,25.84 arc(25.99,25.85) R54.1
  Bottom Layer w0.254: v1(50.88,8.33) 28.27,8.33 arc(26.66,9) 25.99,10.61 v1(25.99,24.2)
ESP32_EN: length 37
  Top Layer w0.254: v1(33.48,37.28) 33.47,37.26 U11.3 28.39,37.26 27.38,36.25 R50.2 ; U12.4 52.18,36.01 v1(50.5,36.01)
  Top Layer w0.508: R50.2 27.39,35.37 C40.2 26.44,33.53 26.12,33.21 26.12,28.49 R58.1
  Bottom Layer w0.254: v1(50.5,36.01) 49.23,37.28 v1(33.48,37.28)
ESP32_IO0: length 12.4
  Top Layer w0.254: U12.1 52.16,32.2 50.88,32.2 50.64,31.95 R51.1 49.73,23.29 U11.25
ESP32_RXD: length 4.6
  Top Layer w0.254: U12.2 50.73,33.49 49.5,34.72 U11.34
ESP32_TXD: length 4.7
  Top Layer w0.254: U11.35 49.37,35.99 50.63,34.74 U12.3
OUT1: length 20.4
  Top Layer w0.254: v1(43.01,9.85) U10.7 38.44,9.85 arc(37.72,10.14) 37.42,10.86 R44.2 ; v1(52.66,11.37) R45.2
  Bottom Layer w0.254: v1(43.01,9.85) 43.01,10.99 arc(43.12,11.26) 43.39,11.37 v1(52.66,11.37)
$1N488: length 3.6
  Top Layer w0.254: R12.2 23.19,10.1 arc(23.19,10.1) R14.1 24.97,10.11 arc(24.98,10.11) R13.1
$1N489: length 10.7
  Top Layer w0.254: R11.2 21.93,5.27 arc(22.38,5.46) 22.56,5.91 22.56,8.26 arc(22.54,8.3) C14.1 20.53,8.32 arc(20.08,8.51) 19.89,8.96 19.89,10.09 arc(19.9,10.1) R12.1
$1N495: length 2
  Top Layer w0.254: C19.2 R11.1
$1N540: length 8.9
  Top Layer w0.254: RF1.5 11.09,5.32 H1.2 C19.1
$1N708: length 2
  Top Layer w0.508: R29.1 17.61,15.3 LED4.1
$1N711:
  vias: v2(2.92,18.76) v2(3.92,18.76)
$1N1033:
  vias: v1(5.42,25.59) v1(5.42,24.58) v1(6.05,27.12) v1(6.62,25.56) v1(6.62,24.56) v1(7.45,27.12) v1(7.96,25.59) v1(7.96,24.58) v1(9.23,25.59) v1(9.23,24.58) v1(10.5,25.59) v1(10.5,24.58)
$1N1130: length 1.8
  Top Layer w0.508: R30.1 3.83,25.05 C21.2
$1N1484: length 5.3
  Top Layer w0.508: U6.3 17.19,25.79 17.73,26.33 17.73,28.26 17.16,28.83 C24.2
$1N1485: length 2.3
  Top Layer w0.508: U6.6 19.08,29.26 C24.1
$1N1490: length 1.7
  Top Layer w0.508: U6.5 20.77,26.74 R28.1
$1N1557: length 2.5
  Top Layer w0.508: R31.1 2.59,28.38 LED5.1
$1N1776: length 2.2
  Top Layer w0.508: LED3.1 17.99,35.76 R3.1
$1N5623: length 20.8
  Top Layer w0.254: 34.88,10.1 34.88,8.32 arc(35.11,7.78) 35.65,7.55 R43.1 38.05,8.58 arc(37.94,8.85) 37.67,8.96 37.29,8.96 arc(37.02,9.07) 36.91,9.34 36.91,10.61 arc(36.8,10.88) 36.53,10.99 arc(36.17,11.14) 36.02,11.5 36.02,13.66 arc(36.28,14.29) 36.91,14.55 37.93,14.55 arc(38.56,14.29) 38.82,13.66 38.82,11.75 arc(39,11.3) 39.45,11.12 U10.6
$1N5830: length 5.4
  Top Layer w0.254: R46.2 R45.1 arc(49.67,11.19) 49.49,11.12 U10.3
$1N5955: length 6.1
  Top Layer w0.254: R48.1 52.4,5.39 arc(52.07,4.59) R47.2
$1N5959: length 4.9
  Top Layer w0.254: R48.2 49.22,9.72 arc(49.14,9.75) R49.2 46.1,9.84 arc(46.1,9.84) U10.2
$1N8059: length 6.1
  Top Layer w0.254: R52.1 50.02,21.8 U11.24
$1N8471: length 16.9
  Top Layer w0.254: U11.30 47.96,29.53 v1(46.06,29.53) ; v1(56.34,25.98) R53.1
  Bottom Layer w0.254: v1(56.34,25.98) 56.34,28.64 55.45,29.53 v1(46.06,29.53)
$1N8523: length 2.7
  Top Layer w0.254: R53.2 54.67,24.61 54.31,24.61
$1N8889: length 2.6
  Top Layer w0.254: U11.12 30.06,25.85 R54.2
$1N15972: length 12.8
  Top Layer w0.254: C41.1 arc(28.51,3.97) 28.42,4 24.85,4 arc(24.22,4.27) 23.96,4.89 23.96,8.27 arc(23.94,8.3) C14.2 25.99,8.32 arc(26.35,8.47) 26.5,8.83 26.5,10.09 arc(26.5,10.1) R13.2
$1N16056: length 4.1
  Top Layer w0.254: C41.2 32.84,3.88 arc(32.85,3.88) R55.2 34.63,3.87 arc(34.63,3.87) R56.1
$1N16195: length 4.1
  Top Layer w0.254: R43.2 C42.2 arc(38.04,3.9) 37.99,3.88 R56.2
$1N16222: length 1.7
  Top Layer w0.254: U10.5 R57.1
$1N16765: length 3.5
  Top Layer w0.508: 22.69,25.33 22.88,25.14 SW1.3 ; 22.69,25.33 C43.1 ; 22.69,25.33 R58.2

## Copper pours and planes (outline as drawn; the poured copper is in the pictures)
AGND on Top Layer: 18.87,9.98 18.88,9.97 18.88,14.29 29.42,14.29 29.42,18.23 60.28,18.23 60.41,18.36 60.41,-3.74 -1.7,-3.74 -1.7,9.98
AGND on Bottom Layer: 18.81,9.98 18.81,9.97 18.81,14.29 29.36,14.29 29.36,18.23 60.22,18.23 60.34,18.36 60.34,-3.74 -1.76,-3.74 -1.76,9.98
GND on Top Layer: 14.05,44.39 14.05,31.56 20.02,31.56 20.02,29.15 21.94,29.15 21.94,18.48 62.82,18.48 62.82,44.39
GND on Bottom Layer: 14.05,44.39 14.05,31.56 20.02,31.56 20.02,29.15 21.94,29.15 21.94,18.48 62.82,18.48 62.82,44.39
PGND on Top Layer: -1.7,10.35 18.5,10.35 18.5,14.66 29.04,14.66 29.04,18.24 21.69,18.24 21.67,18.23 21.67,28.77 19.77,28.77 19.77,31.14 13.72,31.14 13.67,31.18 13.67,42.61 13.42,42.87 -1.7,42.87
PGND on Bottom Layer: -1.82,10.23 18.37,10.23 18.37,14.53 28.91,14.53 28.91,18.12 21.56,18.12 21.55,18.1 21.55,28.64 19.64,28.64 19.64,31.01 13.59,31.01 13.54,31.06 13.54,42.49 13.29,42.74 -1.82,42.74
VCC on Top Layer: 6.62,23 13.49,23 13.49,12.18 6.62,12.18
VCC on Bottom Layer: 6.68,23 13.55,23 13.55,12.18 6.68,12.18
$1N711 on Top Layer: 1.86,21.25 4.53,21.25 4.53,11.88 1.86,11.88
$1N711 on Bottom Layer: 1.92,21.14 4.59,21.14 4.59,11.76 1.92,11.76
$1N1033 on Top Layer: 5.8,27.53 7.7,27.53 7.7,26.11 10.79,26.11 10.79,24.29 10.88,24.2 4.82,24.2 4.82,25.92 5.8,25.92
$1N1033 on Bottom Layer: 5.78,27.52 7.68,27.52 7.68,26.09 10.77,26.09 10.77,24.27 10.86,24.18 4.8,24.18 4.8,25.91 5.78,25.91

Small or netless copper shapes (teardrops, artwork), in the pictures only: 166 on Top Layer, 12 on Bottom Layer

## Text on the board
Bottom Silkscreen Layer: GND | RX | EN | TX | IO0
Top Silkscreen Layer: 5V | 3.3 | DEBUG | IO18 | +5V | IN | -5V | T1 | GND | OPA657 | IO27 | 3V3 | RST | T2 | BANDPA | T3 | LF353 | ESP32WROOM32E | T5 | T4
